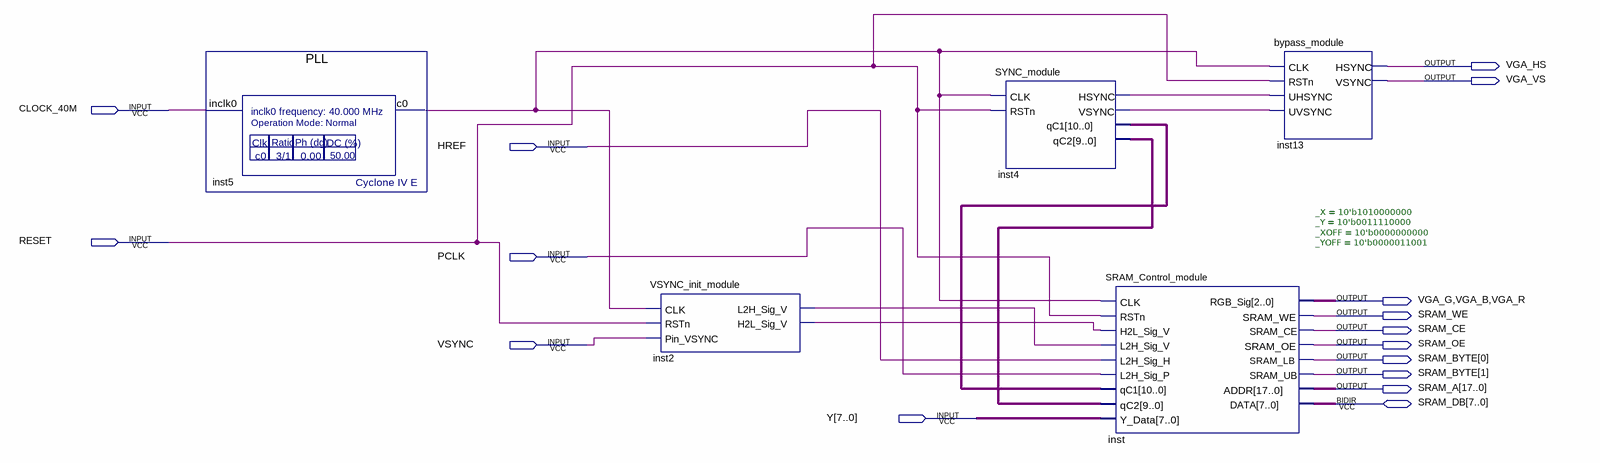
[diagram p0: schematic sheet]
// Quartus schematic _OV7620.bdf as structural Verilog: 5 symbols, 16 pins
module _OV7620 (
  input  CLOCK_40M,
  input  HREF,
  input  RESET,
  input  PCLK,
  input  VSYNC,
  input  [7:0] Y,
  inout  [7:0] SRAM_DB,
  output VGA_HS,
  output VGA_VS,
  output VGA_G,
  output VGA_B,
  output VGA_R,
  output SRAM_WE,
  output SRAM_CE,
  output SRAM_OE,
  output [1:0] SRAM_BYTE,
  output [17:0] SRAM_A
);

  wire inst2_h2l_sig_v, inst2_l2h_sig_v, inst4_hsync, inst4_vsync, inst5_c0;
  wire [9:0] inst4_qc2;
  wire [10:0] inst4_qc1;

  PLL inst5 (.inclk0(CLOCK_40M), .c0(inst5_c0));
  VSYNC_init_module inst2 (
    .CLK(inst5_c0), .RSTn(RESET), .Pin_VSYNC(VSYNC), .L2H_Sig_V(inst2_l2h_sig_v), .H2L_Sig_V(inst2_h2l_sig_v));
  SYNC_module inst4 (
    .CLK(inst5_c0), .RSTn(RESET), .HSYNC(inst4_hsync), .VSYNC(inst4_vsync), .qC1(inst4_qc1), .qC2(inst4_qc2));
  SRAM_Control_module #(._X(10'b1010000000), ._Y(10'b0011110000), ._XOFF(10'b0000000000), ._YOFF(10'b0000011001)) inst (
    .CLK(inst5_c0), .RSTn(RESET), .H2L_Sig_V(inst2_h2l_sig_v), .L2H_Sig_V(inst2_l2h_sig_v), .L2H_Sig_H(HREF),
    .L2H_Sig_P(PCLK), .qC1(inst4_qc1), .qC2(inst4_qc2), .Y_Data(Y), .RGB_Sig({VGA_G, VGA_B, VGA_R}),
    .SRAM_WE(SRAM_WE), .SRAM_CE(SRAM_CE), .SRAM_OE(SRAM_OE), .SRAM_LB(SRAM_BYTE[0]), .SRAM_UB(SRAM_BYTE[1]),
    .ADDR(SRAM_A), .DATA(SRAM_DB));
  bypass_module inst13 (
    .CLK(inst5_c0), .RSTn(RESET), .UHSYNC(inst4_hsync), .UVSYNC(inst4_vsync), .HSYNC(VGA_HS), .VSYNC(VGA_VS));
endmodule
